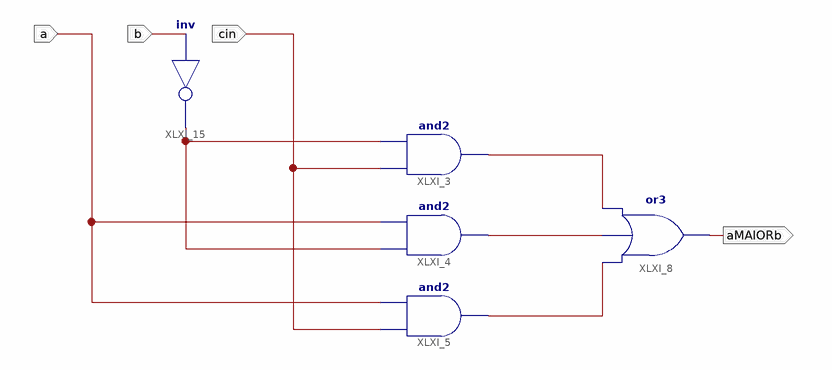
[diagram p0: schematic sheet 1]
// Xilinx ISE schematic ComparadorMaior.sch (xa9500xl) as structural Verilog: 5 symbols, 4 ports
module ComparadorMaior (
  input  a,
  input  b,
  input  cin,
  output aMAIORb
);

  wire XLXN_13, XLXN_14, XLXN_28, XLXN_35;

  and XLXI_3 (XLXN_28, cin, XLXN_35);
  and XLXI_4 (XLXN_13, XLXN_35, a);
  and XLXI_5 (XLXN_14, cin, a);
  or XLXI_8 (aMAIORb, XLXN_14, XLXN_13, XLXN_28);
  not XLXI_15 (XLXN_35, b);
endmodule
